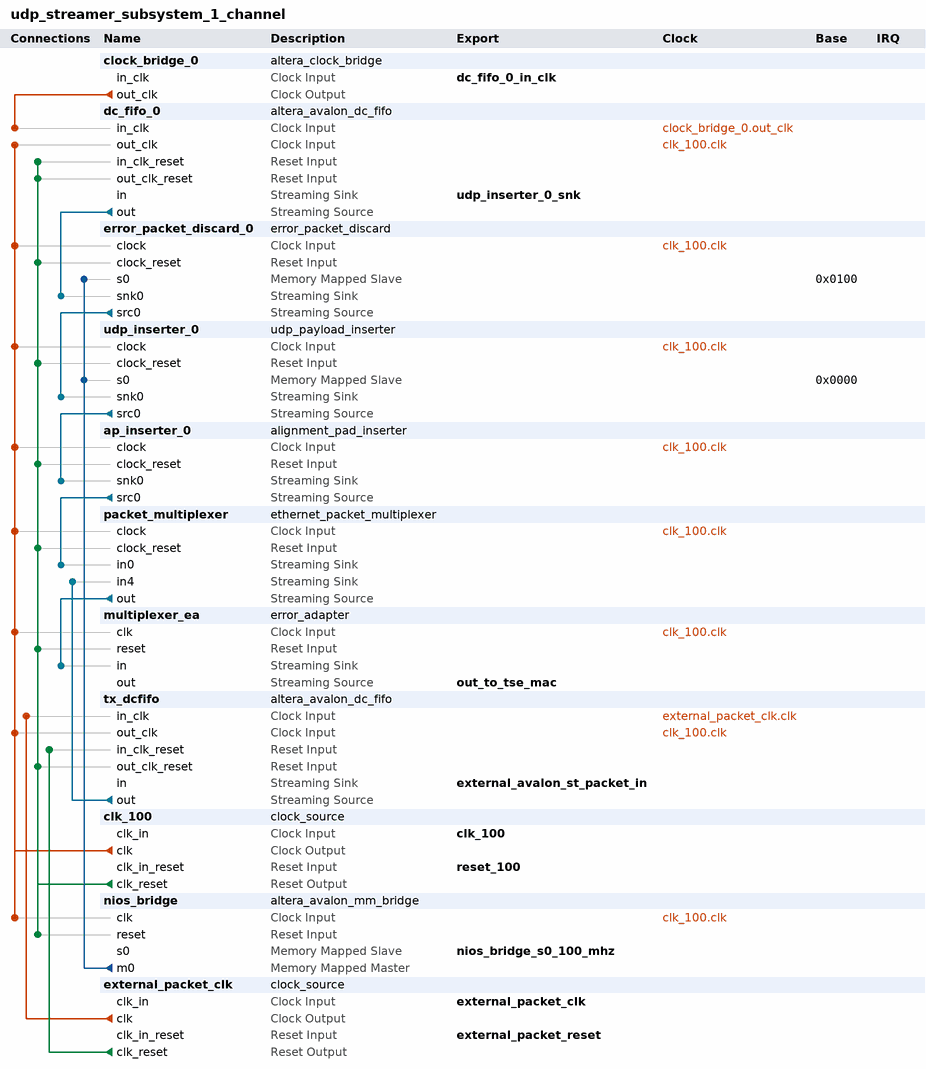
[diagram p0: system contents]
# Platform Designer (Qsys) system udp_streamer_subsystem_1_channel, Cyclone V 5CGXFC4C6F23C7
# Parameters at their usual value, and those the tool derives, are not listed.
package require -exact qsys 14.1
create_system udp_streamer_subsystem_1_channel
set_project_property DEVICE_FAMILY {Cyclone V}
set_project_property DEVICE 5CGXFC4C6F23C7

add_instance clock_bridge_0 altera_clock_bridge 14.1
set_instance_parameter_value clock_bridge_0 DERIVED_CLOCK_RATE 0
set_instance_parameter_value clock_bridge_0 EXPLICIT_CLOCK_RATE 0

add_instance dc_fifo_0 altera_avalon_dc_fifo 14.1
set_instance_parameter_value dc_fifo_0 BITS_PER_SYMBOL 8
set_instance_parameter_value dc_fifo_0 FIFO_DEPTH 1024
set_instance_parameter_value dc_fifo_0 SYMBOLS_PER_BEAT 4
set_instance_parameter_value dc_fifo_0 USE_PACKETS 1

add_instance error_packet_discard_0 error_packet_discard 1.0

add_instance udp_inserter_0 udp_payload_inserter 1.0

add_instance ap_inserter_0 alignment_pad_inserter 1.0

add_instance packet_multiplexer ethernet_packet_multiplexer 1.0

add_instance multiplexer_ea error_adapter 14.1
set_instance_parameter_value multiplexer_ea inBitsPerSymbol 8
set_instance_parameter_value multiplexer_ea inChannelWidth 0
set_instance_parameter_value multiplexer_ea inErrorWidth 0
set_instance_parameter_value multiplexer_ea inMaxChannel 0
set_instance_parameter_value multiplexer_ea inReadyLatency 0
set_instance_parameter_value multiplexer_ea inSymbolsPerBeat 4
set_instance_parameter_value multiplexer_ea inUseEmpty false
set_instance_parameter_value multiplexer_ea inUseEmptyPort AUTO
set_instance_parameter_value multiplexer_ea inUsePackets true
set_instance_parameter_value multiplexer_ea inUseReady true
set_instance_parameter_value multiplexer_ea outErrorWidth 1

add_instance tx_dcfifo altera_avalon_dc_fifo 14.1
set_instance_parameter_value tx_dcfifo BITS_PER_SYMBOL 8
set_instance_parameter_value tx_dcfifo FIFO_DEPTH 2048
set_instance_parameter_value tx_dcfifo RD_SYNC_DEPTH 2
set_instance_parameter_value tx_dcfifo SYMBOLS_PER_BEAT 4
set_instance_parameter_value tx_dcfifo USE_PACKETS 1
set_instance_parameter_value tx_dcfifo WR_SYNC_DEPTH 2

add_instance clk_100 clock_source 14.1
set_instance_parameter_value clk_100 clockFrequency 100000000

add_instance nios_bridge altera_avalon_mm_bridge 14.1
set_instance_parameter_value nios_bridge ADDRESS_UNITS SYMBOLS
set_instance_parameter_value nios_bridge ADDRESS_WIDTH 10
set_instance_parameter_value nios_bridge DATA_WIDTH 32
set_instance_parameter_value nios_bridge MAX_PENDING_RESPONSES 4
set_instance_parameter_value nios_bridge USE_AUTO_ADDRESS_WIDTH 0

add_instance external_packet_clk clock_source 14.1
set_instance_parameter_value external_packet_clk clockFrequency 100000000

# connections
add_connection clk_100.clk ap_inserter_0.clock clock
add_connection clk_100.clk dc_fifo_0.out_clk clock
add_connection clk_100.clk error_packet_discard_0.clock clock
add_connection clk_100.clk multiplexer_ea.clk clock
add_connection clk_100.clk nios_bridge.clk clock
add_connection clk_100.clk packet_multiplexer.clock clock
add_connection clk_100.clk tx_dcfifo.out_clk clock
add_connection clk_100.clk udp_inserter_0.clock clock
add_connection clock_bridge_0.out_clk dc_fifo_0.in_clk clock
add_connection external_packet_clk.clk tx_dcfifo.in_clk clock
add_connection clk_100.clk_reset ap_inserter_0.clock_reset reset
add_connection clk_100.clk_reset dc_fifo_0.in_clk_reset reset
add_connection clk_100.clk_reset dc_fifo_0.out_clk_reset reset
add_connection clk_100.clk_reset error_packet_discard_0.clock_reset reset
add_connection clk_100.clk_reset multiplexer_ea.reset reset
add_connection clk_100.clk_reset nios_bridge.reset reset
add_connection clk_100.clk_reset packet_multiplexer.clock_reset reset
add_connection clk_100.clk_reset tx_dcfifo.out_clk_reset reset
add_connection clk_100.clk_reset udp_inserter_0.clock_reset reset
add_connection external_packet_clk.clk_reset tx_dcfifo.in_clk_reset reset
add_connection nios_bridge.m0 error_packet_discard_0.s0 avalon
set_connection_parameter_value nios_bridge.m0/error_packet_discard_0.s0 baseAddress 0x0100
add_connection nios_bridge.m0 udp_inserter_0.s0 avalon
set_connection_parameter_value nios_bridge.m0/udp_inserter_0.s0 baseAddress 0x0000
add_connection ap_inserter_0.src0 packet_multiplexer.in0 avalon_streaming
add_connection dc_fifo_0.out error_packet_discard_0.snk0 avalon_streaming
add_connection error_packet_discard_0.src0 udp_inserter_0.snk0 avalon_streaming
add_connection packet_multiplexer.out multiplexer_ea.in avalon_streaming
add_connection tx_dcfifo.out packet_multiplexer.in4 avalon_streaming
add_connection udp_inserter_0.src0 ap_inserter_0.snk0 avalon_streaming

# exported interfaces
add_interface clk_100 clock sink
set_interface_property clk_100 EXPORT_OF clk_100.clk_in
add_interface dc_fifo_0_in_clk clock sink
set_interface_property dc_fifo_0_in_clk EXPORT_OF clock_bridge_0.in_clk
add_interface external_avalon_st_packet_in avalon_streaming sink
set_interface_property external_avalon_st_packet_in EXPORT_OF tx_dcfifo.in
add_interface external_packet_clk clock sink
set_interface_property external_packet_clk EXPORT_OF external_packet_clk.clk_in
add_interface external_packet_reset reset sink
set_interface_property external_packet_reset EXPORT_OF external_packet_clk.clk_in_reset
add_interface nios_bridge_s0_100_mhz avalon slave
set_interface_property nios_bridge_s0_100_mhz EXPORT_OF nios_bridge.s0
add_interface out_to_tse_mac avalon_streaming source
set_interface_property out_to_tse_mac EXPORT_OF multiplexer_ea.out
add_interface reset_100 reset sink
set_interface_property reset_100 EXPORT_OF clk_100.clk_in_reset
add_interface udp_inserter_0_snk avalon_streaming sink
set_interface_property udp_inserter_0_snk EXPORT_OF dc_fifo_0.in

set_interconnect_requirement {$system} qsys_mm.clockCrossingAdapter AUTO
set_interconnect_requirement {$system} qsys_mm.maxAdditionalLatency 2

save_system udp_streamer_subsystem_1_channel.qsys
